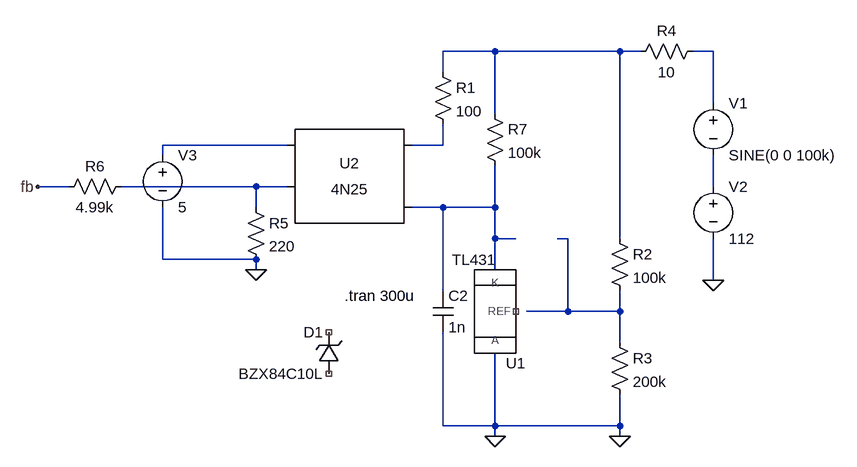
[diagram p0: schematic sch.asc]
sch.asc, the LTspice schematic file:
Version 4
SHEET 1 880 680
WIRE 48 -80 -32 -80
WIRE 240 -80 48 -80
WIRE 272 -80 240 -80
WIRE 384 -80 352 -80
WIRE -32 -48 -32 -80
WIRE 384 0 384 -80
WIRE 48 16 48 -80
WIRE -272 64 -464 64
WIRE -32 64 -32 32
WIRE -32 64 -80 64
WIRE -464 80 -464 64
WIRE -608 128 -656 128
WIRE -320 128 -528 128
WIRE -272 128 -320 128
WIRE 384 128 384 80
WIRE -320 160 -320 128
WIRE -32 160 -80 160
WIRE 48 160 48 96
WIRE 48 160 -32 160
WIRE 48 208 48 160
WIRE 80 208 48 208
WIRE 160 208 144 208
WIRE 240 208 240 -80
WIRE -464 240 -464 160
WIRE -320 240 -464 240
WIRE -320 256 -320 240
WIRE 48 256 48 208
WIRE 384 272 384 208
WIRE -32 288 -32 160
WIRE 160 320 160 208
WIRE 160 320 96 320
WIRE 240 320 240 288
WIRE 240 320 160 320
WIRE 240 368 240 320
WIRE -32 496 -32 352
WIRE 48 496 48 384
WIRE 48 496 -32 496
WIRE 240 496 240 448
WIRE 240 496 48 496
WIRE 48 512 48 496
WIRE 240 512 240 496
FLAG 240 512 0
FLAG 384 272 0
FLAG 48 512 0
FLAG -320 256 0
FLAG -656 128 fb
SYMBOL Optos\\4N25 -176 128 M0
SYMATTR InstName U2
SYMBOL res -48 -64 R0
SYMATTR InstName R1
SYMATTR Value 100
SYMBOL res 224 192 R0
SYMATTR InstName R2
SYMATTR Value 100k
SYMBOL res 224 352 R0
SYMATTR InstName R3
SYMATTR Value 200k
SYMBOL zener -192 416 R180
WINDOW 0 24 64 Left 2
WINDOW 3 24 0 Left 2
SYMATTR InstName D1
SYMATTR Value BZX84C10L
SYMBOL voltage 384 112 R0
WINDOW 123 0 0 Left 0
WINDOW 39 0 0 Left 0
SYMATTR InstName V2
SYMATTR Value 112
SYMBOL AutoGenerated\\TL431 48 320 R180
SYMATTR InstName U1
SYMBOL voltage 384 -16 R0
WINDOW 123 0 0 Left 0
WINDOW 39 0 0 Left 0
SYMATTR InstName V1
SYMATTR Value SINE(0 0 100k)
SYMBOL res -336 144 R0
SYMATTR InstName R5
SYMATTR Value 220
SYMBOL voltage -464 64 R0
WINDOW 123 0 0 Left 0
WINDOW 39 0 0 Left 0
SYMATTR InstName V3
SYMATTR Value 5
SYMBOL res -512 112 R90
WINDOW 0 0 56 VBottom 2
WINDOW 3 32 56 VTop 2
SYMATTR InstName R6
SYMATTR Value 4.99k
SYMBOL cap -48 288 R0
SYMATTR InstName C2
SYMATTR Value 1n
SYMBOL res 368 -96 R90
WINDOW 0 0 56 VBottom 2
WINDOW 3 32 56 VTop 2
SYMATTR InstName R4
SYMATTR Value 10
SYMBOL res 32 0 R0
SYMATTR InstName R7
SYMATTR Value 100k
TEXT -184 296 Left 2 !.tran 300u

The netlist it stands for:
* sch.asc
XU2 N004 N007 N003 N005 NC_01 4N25
R1 N001 N004 100
R2 N001 N008 100k
R3 N008 0 200k
D1 NC_02 NC_03 BZX84C10L
V2 N006 0 112
XU1 NC_04 0 N007 TL431  ; pins REF A K
V1 N002 N006 SINE(0 0 100k)
R5 N005 0 220
V3 N003 0 5
R6 N005 fb 4.99k
C2 N007 0 1n
R4 N002 N001 10
R7 N001 N007 100k
.model D D
.lib standard.dio
.tran 300u
.lib 4N25.sub
.lib D:\00 - ITBA\Electrónica 4\TPF\TP-FINAL\Simulation\OTROS\PWM\tl431.mod
.backanno
.end